# EAGLE design pipower (EAGLE 7.5.0)
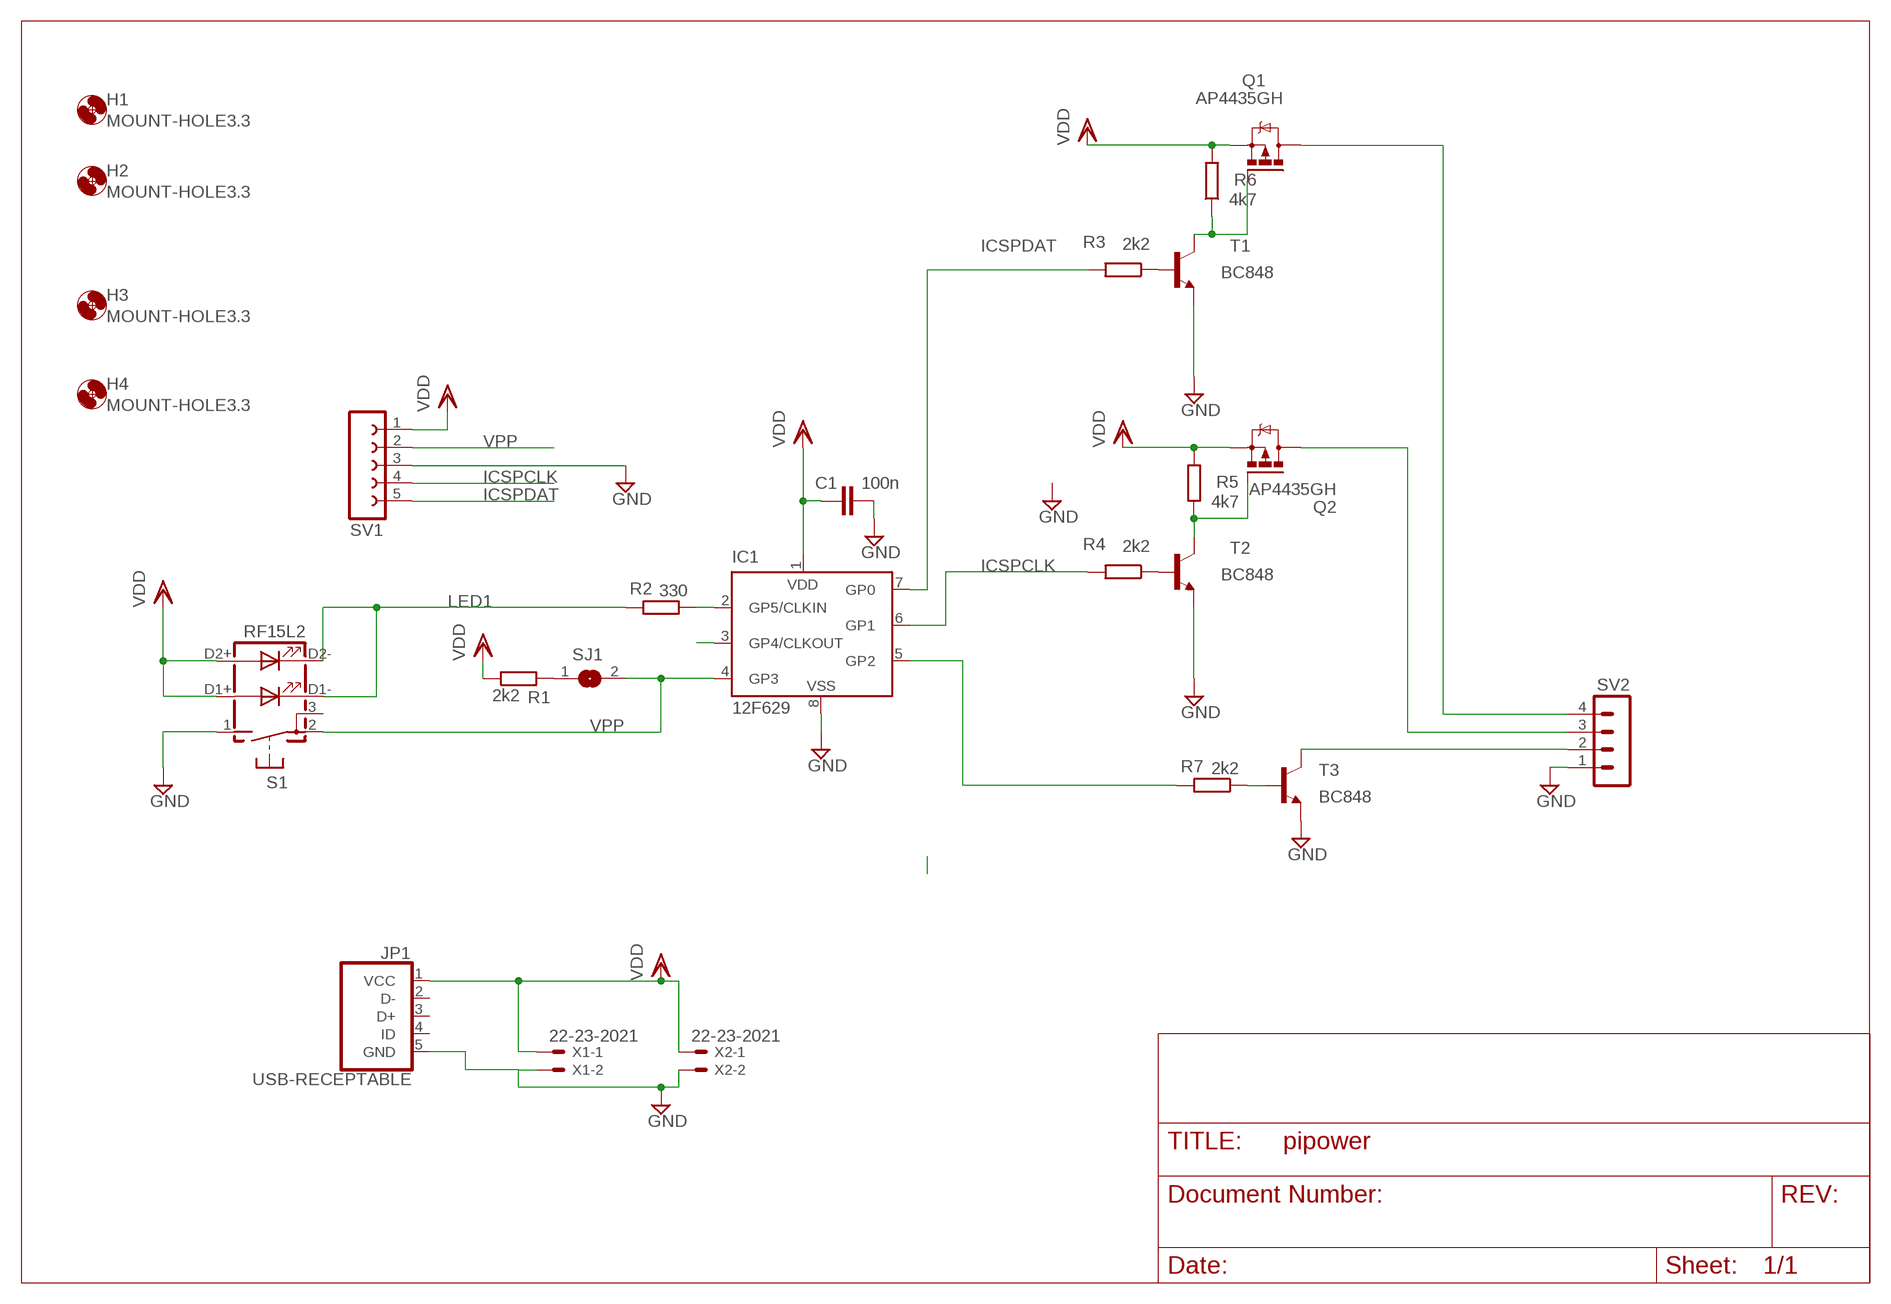
[diagram p0: schematic, sheet 1]

## Parts
C1  100n  C-EUC0805  [C0805]
H1  MOUNT-HOLE3.3  [3,3]
H2  MOUNT-HOLE3.3  [3,3]
H3  MOUNT-HOLE3.3  [3,3]
H4  MOUNT-HOLE3.3  [3,3]
IC1  12F629  PIC12F629SN  [SO-08]
JP1  USB-RECEPTABLE  [FCI-10103594-0001LF]
Q1  AP4435GH  IRFR5305  [D-PAK_TO252AA]
Q2  AP4435GH  IRFR5305  [D-PAK_TO252AA]
R1  2k2  R-EU_R0805  [R0805]
R2  330  R-EU_R0805  [R0805]
R3  2k2  R-EU_R0805  [R0805]
R4  2k2  R-EU_R0805  [R0805]
R5  4k7  R-EU_R0805  [R0805]
R6  4k7  R-EU_R0805  [R0805]
R7  2k2  R-EU_R0805  [R0805]
S1  RF15L2  [RF15L2]
SJ1  SJ  [SJ]
SV1  FE05-1  [FE05-1]
SV2  MA04-1  [MA04-1]
T1  BC848  [SOT23]
T2  BC848  [SOT23]
T3  BC848  [SOT23]
X1  22-23-2021  [22-23-2021]
X2  22-23-2021  [22-23-2021]

## Nets
GND: C1.2 IC1.8(VSS) JP1.5(GND) S1.1(S) SV1.3 SV2.1 T1.2(E) T2.2(E) T3.2(E) X1.2 X2.2
ICSPCLK: IC1.6(GP1) R4.2 SV1.4
ICSPDAT: IC1.7(GP0) R3.2 SV1.5
LED1: R2.2 S1.D1-(C1) S1.D2-(C2)
N$1: IC1.5(GP2) R7.2
N$2: Q1.4(D) SV2.4
N$3: Q2.1(G) R5.1 T2.3(C)
N$5: R3.1 T1.1(B)
N$6: R1.2 SJ1.1
N$7: R4.1 T2.1(B)
N$8: Q2.4(D) SV2.3
N$9: Q1.1(G) R6.1 T1.3(C)
N$10: IC1.2(GP5/CLKIN) R2.1
N$11: SV2.2 T3.3(C)
N$16: R7.1 T3.1(B)
N$17: IC1.3(GP4/CLKOUT)
VDD: C1.1 IC1.1(VDD) JP1.1(VCC) Q1.3(S) Q2.3(S) R1.1 R5.2 R6.2 S1.D1+(A1) S1.D2+(A2) SV1.1 X1.1 X2.1
VPP: IC1.4(GP3) S1.2(P) SJ1.2 SV1.2
Unconnected: JP1.2(D-) JP1.3(D+) JP1.4(ID) S1.3(P)

## Library data of the parts
C1 = rcl:C-EU: CAPACITOR, European symbol
H1-H4 = holes:MOUNT-HOLE: MOUNTING HOLE with drill center marker
IC1 = microchip:PIC12F6*: Data Sheet 8-Pin FLASH-Based 8-Bit CMOS Microcontrollers Source: http://www.microchip.com .. 41190c.pdf; MF: MICROCHIP; MPN: PIC12F629-I/SN; OC_FARNELL: 9759000; OC_NEWARK: 61K3433
JP1 = daspilker:USB-RECEPTABLE: USB Receptable
Q1 Q2 = transistor-power:IRF?5305: HEXFET Power MOSFET Source: http://www.irf.com/product-info/datasheets/data/irfr5305pbf.pdf
R1-R7 = rcl:R-EU_: RESISTOR, European symbol
S1 = switch-misc:RF15L2: RAFI SWITCH
SJ1 = jumper:SJ: SMD solder JUMPER
SV1 = con-lsta:FE05-1: FEMALE HEADER; OC_FARNELL: unknown; OC_NEWARK: unknown
SV2 = con-lstb:MA04-1: PIN HEADER; OC_FARNELL: unknown; OC_NEWARK: unknown
T1-T3 = transistor:BC848: NPN TRANSISTOR
X1 X2 = con-molex:22-23-2021: .100" (2.54mm) Center Header - 2 Pin; MF: MOLEX; MPN: 22-23-2021; OC_FARNELL: 1462926; OC_NEWARK: 25C3832

## Net classes
1 control: width 0.61 mm, clearance 0.762 mm

## Board
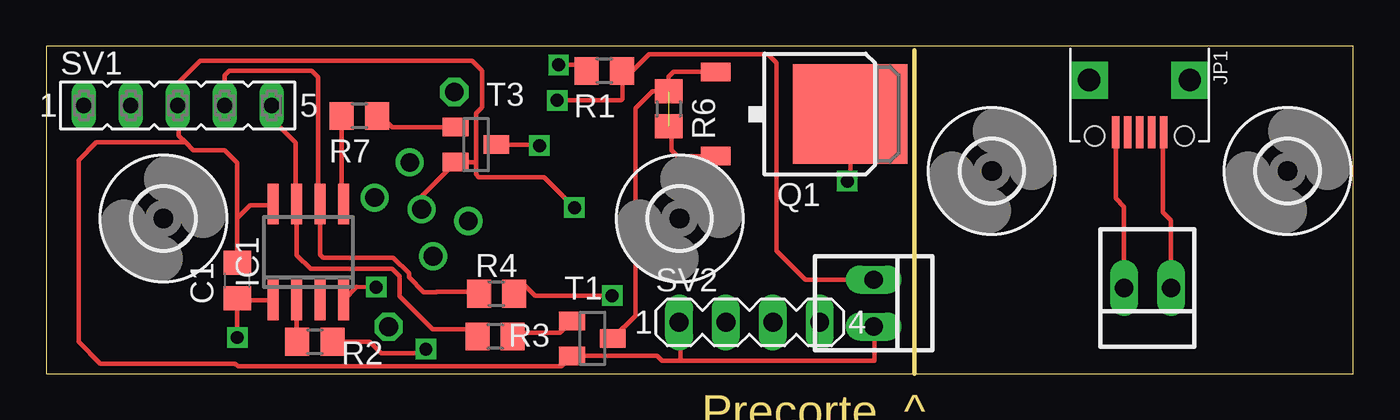
[diagram p1: board, top side]
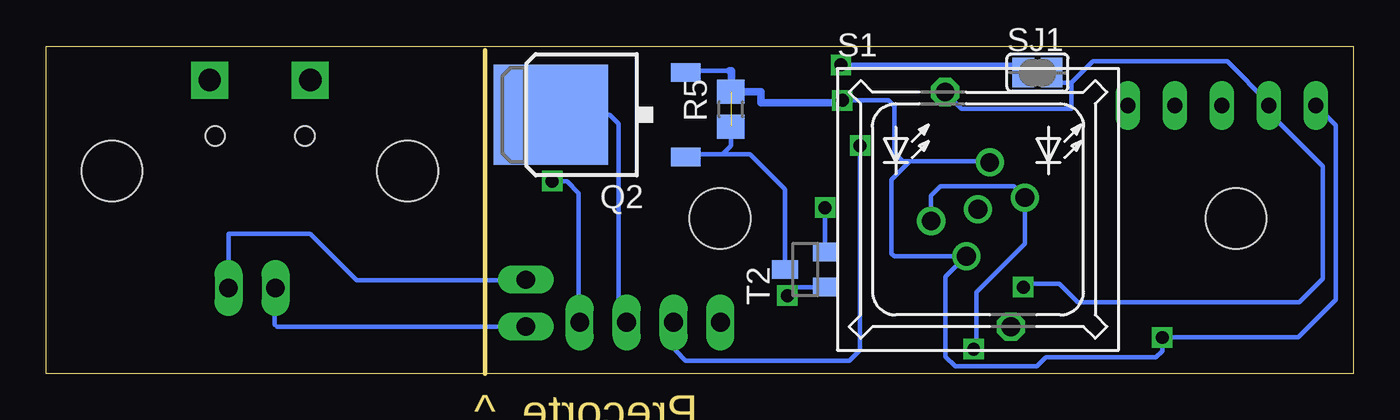
[diagram p2: board, bottom side, seen from below]

Size 70.77 x 17.72 mm. Coordinates in mm from the lower left corner, seen from the top.
Outline: 47,0 0,0 0,17.72 70.77,17.72 70.77,0 47,0
Outline: 47,17.5 47,0
Copper layers (1*16): Top 0.035mm / dielectric 1.5mm / Bottom 0.035mm
Design rules "default": minimum track width 10mil, minimum drill 24mil, track to track 8mil, track to pad 8mil, pad to pad 8mil, via to via 8mil, smd to smd 8mil, copper to edge 40mil, drill to drill 8mil, minimum pad ring 10mil, minimum via ring 8mil, stop-mask expansion 4mil, vias tented up to drill 0mil, thermal gap 10mil

### Footprints (pad centres in the part's own frame; a part is rotated, then mirrored left to right if it is on the bottom)
C0805 = smd 1.3 x 1.5: 1 -0.95,0; 2 0.95,0
3,3 = hole 3.3: 0,0
SO-08 = smd 0.6 x 2.2: 1 -1.905,-2.6; 2 -0.635,-2.6; 3 0.635,-2.6; 4 1.905,-2.6; 5 1.905,2.6; 6 0.635,2.6; 7 -0.635,2.6; 8 -1.905,2.6
FCI-10103594-0001LF = smd 0.4 x 1.75: 1 -1.3,4.525; 2 -0.65,4.525; 3 0,4.525; 4 0.65,4.525; 5 1.3,4.525 | drill 1.2 pad 2 square: P$3 -2.725,1.7; P$4 2.725,1.7 | hole 1.05: -2.425,4.73; 2.425,4.73
D-PAK_TO252AA = smd 1 x 1.6: 1 -2.28,-4.8; 3 2.28,-4.8 | smd 5.4 x 6.2: 4 0,2.5
R0805 = smd 1.3 x 1.5: 1 -0.95,0; 2 0.95,0
RF15L2 = drill 1.016: 1 0,0; D1+ 0.635,2.54; D1- 2.54,0.635; D2+ -0.635,-2.54; D2- -2.54,-0.635 | drill 1.016 octagon: 2 -1.778,6.35; 3 1.778,-6.35
SJ = smd 1.168 x 1.6: 1 -0.762,0; 2 0.762,0
FE05-1 = drill 0.813 long: 1 -5.08,0; 2 -2.54,0; 3 0,0; 4 2.54,0; 5 5.08,0
MA04-1 = drill 1.016 long: 1 -3.81,0; 2 -1.27,0; 3 1.27,0; 4 3.81,0
SOT23 = smd 1 x 1.4: 1 -0.95,-1.1; 2 0.95,-1.1; 3 0,1.1
22-23-2021 = drill 1 long: 1 -1.27,0; 2 1.27,0

### Placement (x,y rotation side)
C1  10.35,5.04 90 top
H1  67.21,10.97 0 top
H2  51.2,10.97 0 top
H3  34.29,8.39 0 top
H4  6.35,8.39 0 top
IC1  14.2,6.58 0 top
JP1  59.19,17.59 180 top
Q1  41.04,14.05 270 top
Q2  40.95,14.01 90 bottom
R1  30.22,16.38 180 top
R2  14.55,1.73 0 top
R3  24.31,2.01 180 top
R4  24.38,4.32 180 top
R5  33.71,14.3 90 bottom
R6  33.7,14.33 270 top
R7  16.96,13.94 180 top
S1  20.32,8.89 0 bottom
SJ1  17.1,16.29 0 bottom
SV1  7.12,14.51 0 top
SV2  38.07,2.77 0 top
T1  29.58,1.91 270 top
T2  29.67,5.63 90 bottom
T3  23.27,12.39 270 top
X1  59.63,4.64 180 top
X2  44.81,3.81 270 top

### Tracks (layer width: path | path; a pad name or v marks a point on that pad's centre or on a via)
GND  (via drill 0.7)
  Top 0.254: IC1.8 12.24,9.12 11.05,9.12 10.35,8.42 | 10.35,8.42 C1.2 | 7.55,12.51 7.18,12.87 7.18,14.45 SV1.3 7.12,15.71 8.35,16.94 23.05,16.94 23.61,16.38 23.61,14.41 23.27,14.08 23.27,11.43 | 7.55,12.51 7.96,12.1 9.65,12.1 10.35,11.4 10.35,8.42 | 23.27,11.43 23.26,11.45 T3.2 20.32,9.59 S1.1 | 34.35,0.7 33.33,0.7 33.07,0.96 T1.2 27.91,0.39 10.39,0.39 10.23,0.55 2.92,0.55 1.75,1.72 1.75,11.54 2.72,12.51 7.55,12.51 | 34.35,0.7 44.84,0.7 44.84,2.51 X2.2 | SV2.1 34.35,2.69 34.35,0.7 | v28.6,8.98 26.96,10.62 25.3,10.62 25.28,10.63 23.42,10.63 23.27,10.79 23.27,11.43 | JP1.5 57.91,13.05 57.91,9.48 58.36,9.03 X1.2
  Bottom 0.254: T2.2 28.6,6.61 v28.6,8.98 | X1.2 58.39,4.6 58.39,2.66 58.27,2.54 X2.2
ICSPCLK
  Top 0.254: SV1.4 9.66,16.14 9.9,16.39 14.37,16.39 14.72,16.03 14.72,9.29 IC1.6 14.84,6.43 14.99,6.27 18.79,6.27 19.64,5.42 19.64,5.21 20.44,4.41 21.13,4.41 21.15,4.43 23.32,4.43 R4.2
ICSPDAT
  Top 0.254: IC1.7 13.5,9.24 13.5,12.5 12.2,13.8 SV1.5 | IC1.7 13.62,9.13 | R3.2 22.97,2.4 20.92,2.4 19.13,4.19 19.13,5.26 18.72,5.67 14.31,5.67 13.56,6.41 IC1.7
LED1  (via drill 0.7)
  Top 0.254: 15.41,1.33 R2.2 17.52,1.73 18.14,1.11 20.34,1.11 v20.56,1.33
  Bottom 0.254: S1.D2- 22.86,9.63 22.36,10.13 18.39,10.13 S1.D1- 17.78,7.02 20.41,4.39 20.41,1.48 v20.56,1.33
N$1
  Top 0.254: IC1.5 16,9.28 R7.2
N$2  (via drill 0.7)
  Top 0.254: v43.38,10.42 43.54,10.58 Q1.4
  Bottom 0.254: SV2.4 41.94,2.83 41.94,9.77 42.58,10.42 v43.38,10.42
N$3
  Bottom 0.254: Q2.1 36,11.88 34.15,11.88 | 34.15,11.88 33.71,12.32 R5.1 | 34.15,11.88 34.14,11.86 32.66,11.86 30.77,9.97 T2.3
N$5
  Top 0.254: R3.1 25.47,2.21 27.83,2.21 T1.1
N$6  (via drill 0.7)
  Top 0.254: 27.52,16.49 v27.74,16.71 28.94,16.71 R1.2
  Bottom 0.254: SJ1.1 18.29,16.71 v27.74,16.71
N$7  (via drill 0.7)
  Top 0.254: R4.1 25.85,4.84 26.46,4.22 v30.64,4.22
  Bottom 0.254: v30.64,4.22 30.18,4.68 T2.1
N$8
  Bottom 0.254: SV2.3 39.79,3.22 39.79,13.52 40.27,14.01 Q2.4
N$9
  Top 0.254: Q1.1 36.23,16.34 33.97,16.34 33.7,16.08 R6.1 32.83,15.28 31.9,14.35 31.9,3.13 T1.3
N$10
  Top 0.254: R2.1 13.56,1.76 IC1.2
N$11  (via drill 0.7)
  Top 0.254: v26.7,12.34 26.64,12.39 T3.3
  Bottom 0.254: SV2.2 36.71,2.68 36.71,1.25 36.14,0.69 27.27,0.69 26.7,1.25 v26.7,12.34
N$16
  Top 0.254: R7.1 18.12,13.94 18.72,13.35 T3.1
VDD  (via drill 0.7)  (1 unrouted)
  Top 0.254: IC1.1 10.35,3.98 C1.1 v10.35,1.96 | v27.67,14.79 31.13,14.79 31.2,14.87 31.2,16.34 R1.1 31.74,16.38 32.63,17.27 39.08,17.27 39.54,16.81 39.54,6.64 41.11,5.07 X2.1 | JP1.1 60.45,13.02 60.45,8.74 60.9,8.3 X1.1 | R6.2 33.85,13.22 33.85,12.1 34.19,11.77 Q1.3
  Bottom 0.254: S1.D1+ 19.75,11.5 24,11.5 | 24,11.5 25,10.5 25,6.5 24.85,6.35 S1.D2+ 22.07,5.23 22.07,0.92 21.55,0.4 17.13,0.4 16.64,0.89 10.68,0.89 10.35,1.22 v10.35,1.96 2.99,1.96 0.96,3.98 0.96,13.43 SV1.1 | 24,11.5 24.37,11.5 24.84,11.97 24.84,14.46 25.18,14.79 v27.67,14.79 | X2.1 44.84,5.05 53.97,5.05 56.48,7.56 60.9,7.56 X1.1 | Q2.3 36.06,16.38 33.78,16.38 33.71,16.3 R5.2
  Bottom 0.406: 33.78,16.38 33.67,16.38 33.67,15.26 32.08,15.26 32.08,14.65 27.67,14.65 v27.67,14.79
VPP  (via drill 0.7)
  Top 0.254: IC1.4 16.82,4.69 v17.87,4.68
  Bottom 0.254: v17.87,4.68 18.26,4.87 15.92,4.87 14.92,3.87 2.92,3.87 1.66,5.13 1.66,11.22 4.58,14.14 SV1.2 4.58,14.64 6.83,16.89 14.11,16.89 15.25,15.75 | S1.2 21.21,14.35 15.25,14.35 15.25,15.75 | SJ1.2 15.8,15.75 15.25,15.75

### Text on the board
Dimension: Precorte ^